# EAGLE design 2led_Arduino_V2 (EAGLE 8.7.1)
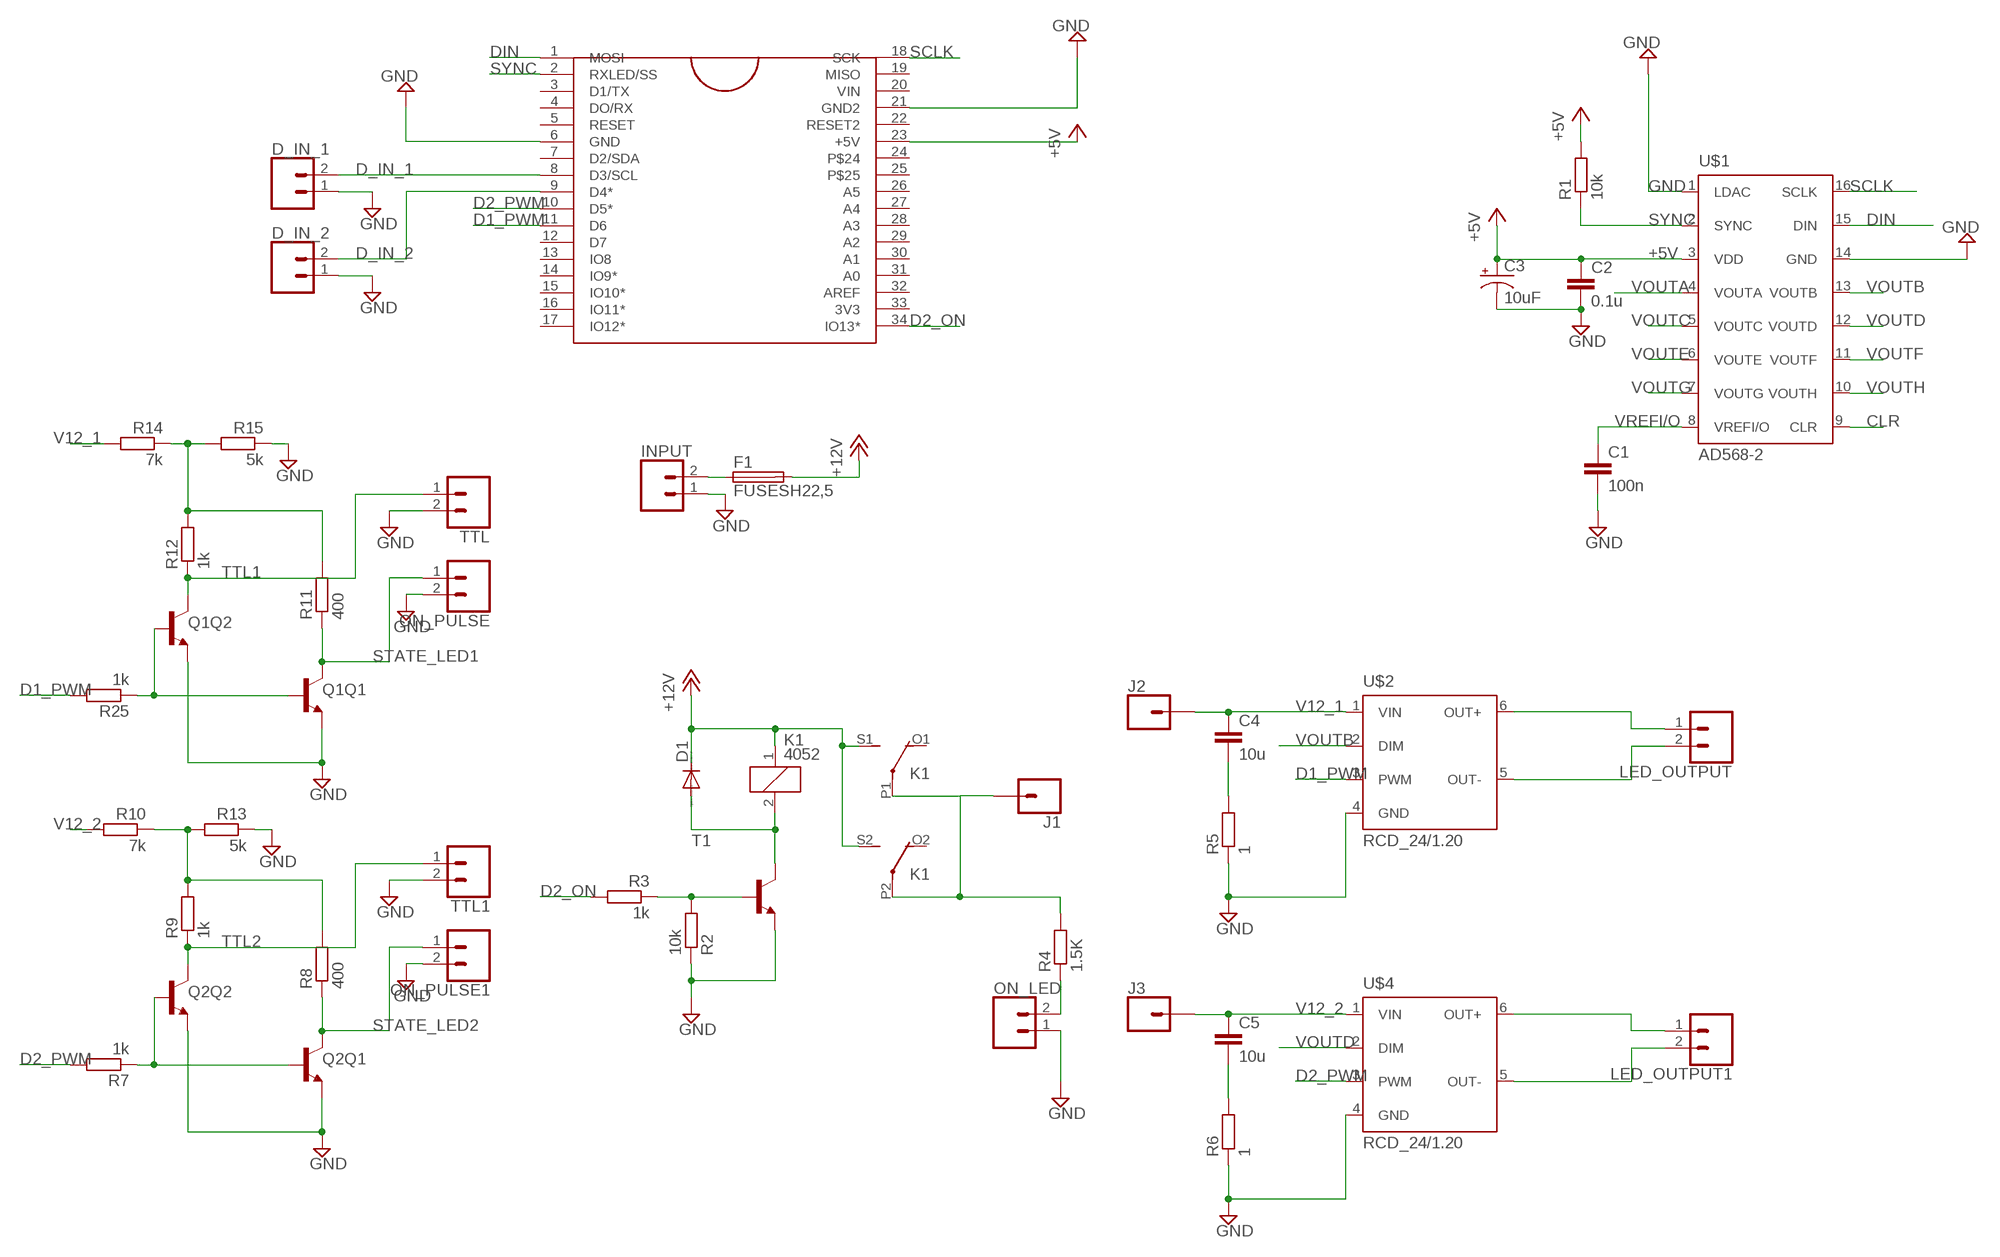
[diagram p0: schematic, sheet 1]

## Parts
C1  100n  C-EUC1206  [C1206]
C2  0.1u  C-EUC1206  [C1206]
C3  10uF  10UF-POLAR-EIA3528-20V-10%(TANT)  [EIA3528]
C4  10u  C-EUC1206  [C1206]
C5  10u  C-EUC1206  [C1206]
D1  DIODE-DO214AC  [DO214AC]
D_IN_1  CONN_02  [1X02]
D_IN_2  CONN_02  [1X02]
F1  FUSESH22,5  [SH22,5]
INPUT  CONN_023.5MM  [SCREWTERMINAL-3.5MM-2]
J1  CONN_01  [1X01]
J2  CONN_01  [1X01]
J3  CONN_01  [1X01]
K1  4052  [F4052]
LED_OUTPUT  CONN_023.5MM  [SCREWTERMINAL-3.5MM-2]
LED_OUTPUT1  CONN_023.5MM  [SCREWTERMINAL-3.5MM-2]
ON_LED  CONN_02  [1X02]
ON_PULSE  CONN_02  [1X02]
ON_PULSE1  CONN_02  [1X02]
Q1  TRANS_NPN_DUAL_NSM4002-MBT3904DW1T1  [SC70-6]
Q2  TRANS_NPN_DUAL_NSM4002-MBT3904DW1T1  [SC70-6]
R1  10k  R-EU_R0805  [R0805]
R2  10k  R-EU_R0805  [R0805]
R3  1k  R-EU_R0805  [R0805]
R4  1.5K  R-EU_R0805  [R0805]
R5  1  R-EU_R1206  [R1206]
R6  1  R-EU_R1206  [R1206]
R7  1k  R-EU_R0805  [R0805]
R8  400  R-EU_R0805  [R0805]
R9  1k  R-EU_R0805  [R0805]
R10  7k  R-EU_R0805  [R0805]
R11  400  R-EU_R0805  [R0805]
R12  1k  R-EU_R0805  [R0805]
R13  5k  R-EU_R0805  [R0805]
R14  7k  R-EU_R0805  [R0805]
R15  5k  R-EU_R0805  [R0805]
R25  1k  R-EU_R0805  [R0805]
T1  -NPN-SOT223  [SOT223]
TTL  CONN_02  [1X02]
TTL1  CONN_02  [1X02]
U$1  AD568-2  [TSSOP-16]
U$2  RCD_24/1.20  [RCD-24/W/X3]
U$3  ARDUINO_MICRO  [ARDUINO_MICRO_PADS]
U$4  RCD_24/1.20  [RCD-24/W/X3]

## Nets
12VIN: J1.1 K1.P1(2:P) K1.P2(3:P) R4.2
+5V: C2.1 C3.A(+) R1.2 U$1.3(VDD) U$3.23(+5V)
+12V: D1.C F1.2 K1.1 K1.S1(2:S) K1.S2(3:S)
CLR: U$1.9(CLR)
D1_PWM: R25.2 U$2.3(PWM) U$3.11(D6)
D2_ON: R3.2 U$3.34(IO13*)
D2_PWM: R7.2 U$3.10(D5*) U$4.3(PWM)
D_IN_1: D_IN_1.2 U$3.8(D3/SCL)
D_IN_2: D_IN_2.2 U$3.9(D4*)
DIN: U$1.15(DIN) U$3.1(MOSI)
GND: C1.2 C2.2 C3.C(-) D_IN_1.1 D_IN_2.1 INPUT.1 ON_LED.1 ON_PULSE1.2 ON_PULSE.2 Q1.1(Q2:E) Q1.4(Q1:E) Q2.1(Q2:E) Q2.4(Q1:E) R2.1 R5.1 R6.1 R13.1 R15.1 T1.3(E) TTL1.2 TTL.2 U$1.1(LDAC) U$1.14(GND) U$2.4(GND) U$3.6(GND) U$3.21(GND2) U$4.4(GND)
N$1: C4.2 R5.2
N$2: D1.A K1.2 T1.4(C)
N$3: F1.1 INPUT.2
N$4: ON_LED.2 R4.1
N$5: R2.2 R3.1 T1.1(B)
N$6: LED_OUTPUT.2 U$2.5(OUT-)
N$7: LED_OUTPUT.1 U$2.6(OUT+)
N$8: LED_OUTPUT1.2 U$4.5(OUT-)
N$9: LED_OUTPUT1.1 U$4.6(OUT+)
N$10: Q1.2(Q2:B) Q1.5(Q1:B) R25.1
N$11: C5.2 R6.2
N$12: Q2.2(Q2:B) Q2.5(Q1:B) R7.1
N$14: R8.2 R9.2 R10.1 R13.2
N$16: R11.2 R12.2 R14.1 R15.2
SCLK: U$1.16(SCLK) U$3.18(SCK)
STATE_LED1: ON_PULSE.1 Q1.3(Q1:C) R11.1
STATE_LED2: ON_PULSE1.1 Q2.3(Q1:C) R8.1
SYNC: R1.1 U$1.2(SYNC) U$3.2(RXLED/SS)
TTL1: Q1.6(Q2:C) R12.1 TTL.1
TTL2: Q2.6(Q2:C) R9.1 TTL1.1
V12_1: C4.1 J2.1 R14.2 U$2.1(VIN)
V12_2: C5.1 J3.1 R10.2 U$4.1(VIN)
VOUTA: U$1.4(VOUTA)
VOUTB: U$1.13(VOUTB) U$2.2(DIM)
VOUTC: U$1.5(VOUTC)
VOUTD: U$1.12(VOUTD) U$4.2(DIM)
VOUTE: U$1.6(VOUTE)
VOUTF: U$1.11(VOUTF)
VOUTG: U$1.7(VOUTG)
VOUTH: U$1.10(VOUTH)
VREFI/O: C1.1 U$1.8(VREFI/O)
Unconnected: K1.O1(2:O) K1.O2(3:O) U$3.3(D1/TX) U$3.4(DO/RX) U$3.5(RESET) U$3.7(D2/SDA) U$3.12(D7) U$3.13(IO8) U$3.14(IO9*) U$3.15(IO10*) U$3.16(IO11*) U$3.17(IO12*) U$3.19(MISO) U$3.20(VIN) U$3.22(RESET2) U$3.24 U$3.25 U$3.26(A5) U$3.27(A4) U$3.28(A3) U$3.29(A2) U$3.30(A1) U$3.31(A0) U$3.32(AREF) U$3.33(3V3)

## Library data of the parts
C1 C2 C4 C5 = rcl:C-EU: CAPACITOR, European symbol; SPICEPREFIX: C
C3 = SparkFun-Capacitors:10UF-POLAR: 10.0µF polarized capacitors A capacitor is a passive two-terminal electrical component used to store electrical energy temporarily in an electric field.; PROD_ID: CAP-08063
D1 = diode:DIODE-: DIODE
D_IN_1 D_IN_2 ON_LED ON_PULSE ON_PULSE1 TTL TTL1 = SparkFun-Connectors:CONN_02: Multi connection point. Often used as Generic Header-pin footprint for 0.1 inch spaced/style header connections On any of the 0.1 inch spaced packages, you can populate with these: Break Away Headers - Straight <https://www.sparkfun.com/products/116> (PRT-00116) Break Away Male Headers - Right Angle <https://www.sparkfun.com/products/553> (PRT-00553) Female Headers <https://www.sparkfun.com/products/115> (PRT-00115) Break Away Headers - Machine Pin <https://www.sparkfun.com/products/117> (PRT-00117) Break Away Female Headers - Swiss Machine Pin <https://www.sparkfun.com/products/743> (PRT-00743) For SCREWTERMINALS and SPRING TERMINALS visit here: Screw Terimnals on SparkFun.com <https://www.sparkfun.com/search/results?term=Screw+Terminals> (5mm/3.5mm/2.54mm spacing) This device is also useful as a general connection point to wire up your design to another part of your project. Our various solder wires solder well into these plated through hole pads. Hook-Up Wire - Assortment (Stranded, 22 AWG) <https://www.sparkfun.com/products/11375> (PRT-11375) Hook-Up Wire - Assortment (Solid Core, 22 AWG) <https://www.sparkfun.com/products/11367> (PRT-11367) View the entire wire category on our website here <https://www.sparkfun.com/categories/141> Special notes: Molex polarized connector foot print use with: PRT-08233 with associated crimp pins and housings. 2.54_SCREWTERM for use with PRT-10571. 3.5mm Screw Terminal footprints for PRT-08084 5mm Screw Terminal footprints for use with PRT-08432
F1 = fuse:FUSE: Fuse; OC_FARNELL: unknown; OC_NEWARK: unknown
INPUT LED_OUTPUT LED_OUTPUT1 = SparkFun-Connectors:CONN_02: Multi connection point. Often used as Generic Header-pin footprint for 0.1 inch spaced/style header connections On any of the 0.1 inch spaced packages, you can populate with these: Break Away Headers - Straight <https://www.sparkfun.com/products/116> (PRT-00116) Break Away Male Headers - Right Angle <https://www.sparkfun.com/products/553> (PRT-00553) Female Headers <https://www.sparkfun.com/products/115> (PRT-00115) Break Away Headers - Machine Pin <https://www.sparkfun.com/products/117> (PRT-00117) Break Away Female Headers - Swiss Machine Pin <https://www.sparkfun.com/products/743> (PRT-00743) For SCREWTERMINALS and SPRING TERMINALS visit here: Screw Terimnals on SparkFun.com <https://www.sparkfun.com/search/results?term=Screw+Terminals> (5mm/3.5mm/2.54mm spacing) This device is also useful as a general connection point to wire up your design to another part of your project. Our various solder wires solder well into these plated through hole pads. Hook-Up Wire - Assortment (Stranded, 22 AWG) <https://www.sparkfun.com/products/11375> (PRT-11375) Hook-Up Wire - Assortment (Solid Core, 22 AWG) <https://www.sparkfun.com/products/11367> (PRT-11367) View the entire wire category on our website here <https://www.sparkfun.com/categories/141> Special notes: Molex polarized connector foot print use with: PRT-08233 with associated crimp pins and housings. 2.54_SCREWTERM for use with PRT-10571. 3.5mm Screw Terminal footprints for PRT-08084 5mm Screw Terminal footprints for use with PRT-08432; PROD_ID: CONN-08399
J1-J3 = SparkFun-Connectors:CONN_01: Single connection point. Often used as Generic Header-pin footprint for 0.1 inch spaced/style header connections On any of the 0.1 inch spaced packages, you can populate with these: Break Away Headers - Straight <https://www.sparkfun.com/products/116> (PRT-00116) Break Away Male Headers - Right Angle <https://www.sparkfun.com/products/553> (PRT-00553) Female Headers <https://www.sparkfun.com/products/115> (PRT-00115) Break Away Headers - Machine Pin <https://www.sparkfun.com/products/117> (PRT-00117) Break Away Female Headers - Swiss Machine Pin <https://www.sparkfun.com/products/743> (PRT-00743) This device is also useful as a general connection point to wire up your design to another part of your project. Our various solder wires solder well into these plated through hole pads. Hook-Up Wire - Assortment (Stranded, 22 AWG) <https://www.sparkfun.com/products/11375> (PRT-11375) Hook-Up Wire - Assortment (Solid Core, 22 AWG) <https://www.sparkfun.com/products/11367> (PRT-11367) View the entire wire category on our website here <https://www.sparkfun.com/categories/141> Special notes: SMTSO-256-ET is a "flush mount" nut for a 4-40 screw. We mostly use this on specialty testbeds; it is a nice way to connect hardware to your PCB at an adjustable hieght. Also note, the SNAP packages are for using a snappable style connector. We sell a baggie of snaps and they are also used on two LilyPad designs: Snap Assortment - 30 pack (male and female) <https://www.sparkfun.com/products/11347> (DEV-11347) LilyPad Arduino SimpleSnap <https://www.sparkfun.com/products/10941> (DEV-10941) LilyPad SimpleSnap Protoboard <https://www.sparkfun.com/products/10940> (DEV-10940)
K1 = relay:4052: RELAY 2 x switch, Finder; OC_FARNELL: unknown; OC_NEWARK: unknown
Q1 Q2 = SparkFun-DiscreteSemi:TRANS_NPN_DUAL_NSM4002: Dual NPN Transistors in Single Package The MBT3904W1 puts two general purpose 3904 NPN transistors in a single package. Datasheet <http://www.onsemi.com/pub_link/Collateral/MBT3904DW1T1-D.PDF> SparkFun Products: SparkFun ESP32 Thing <https://www.sparkfun.com/products/13907>; PROD_ID: TRANS-13337
R1-R15 R25 = rcl:R-EU_: RESISTOR, European symbol; SPICEPREFIX: R
T1 = transistor-neu-to92:*-NPN-: NPN Transistror
U$1 = opto_stimulation:AD568-2
U$2 U$4 = opto_stimulation:RCD_24/1.20
U$3 = opto_stimulation:ARDUINO_MICRO; SPICEPREFIX: X

## Board
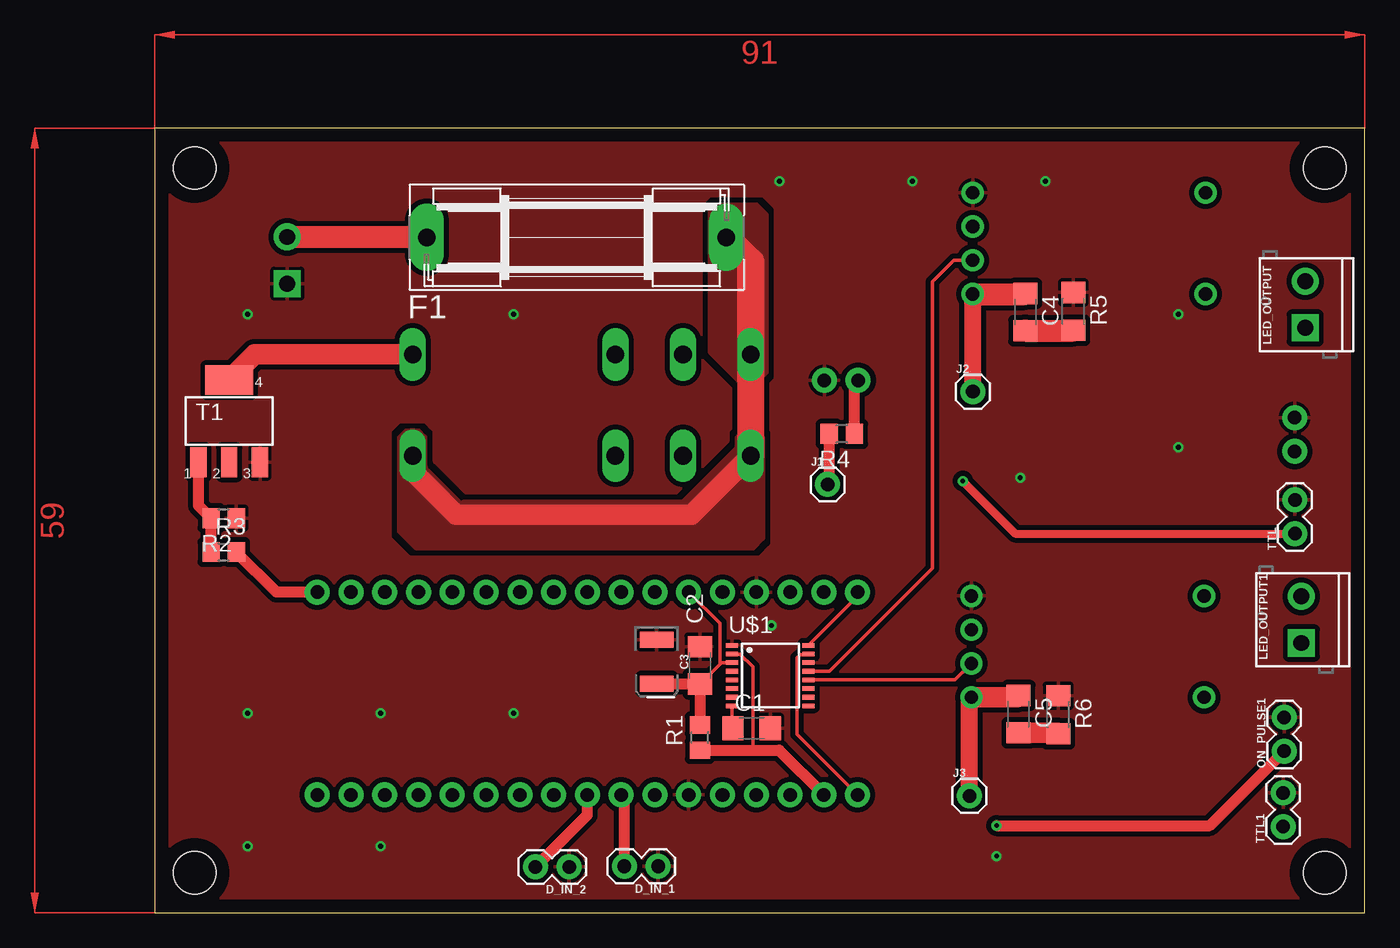
[diagram p1: board, top side]
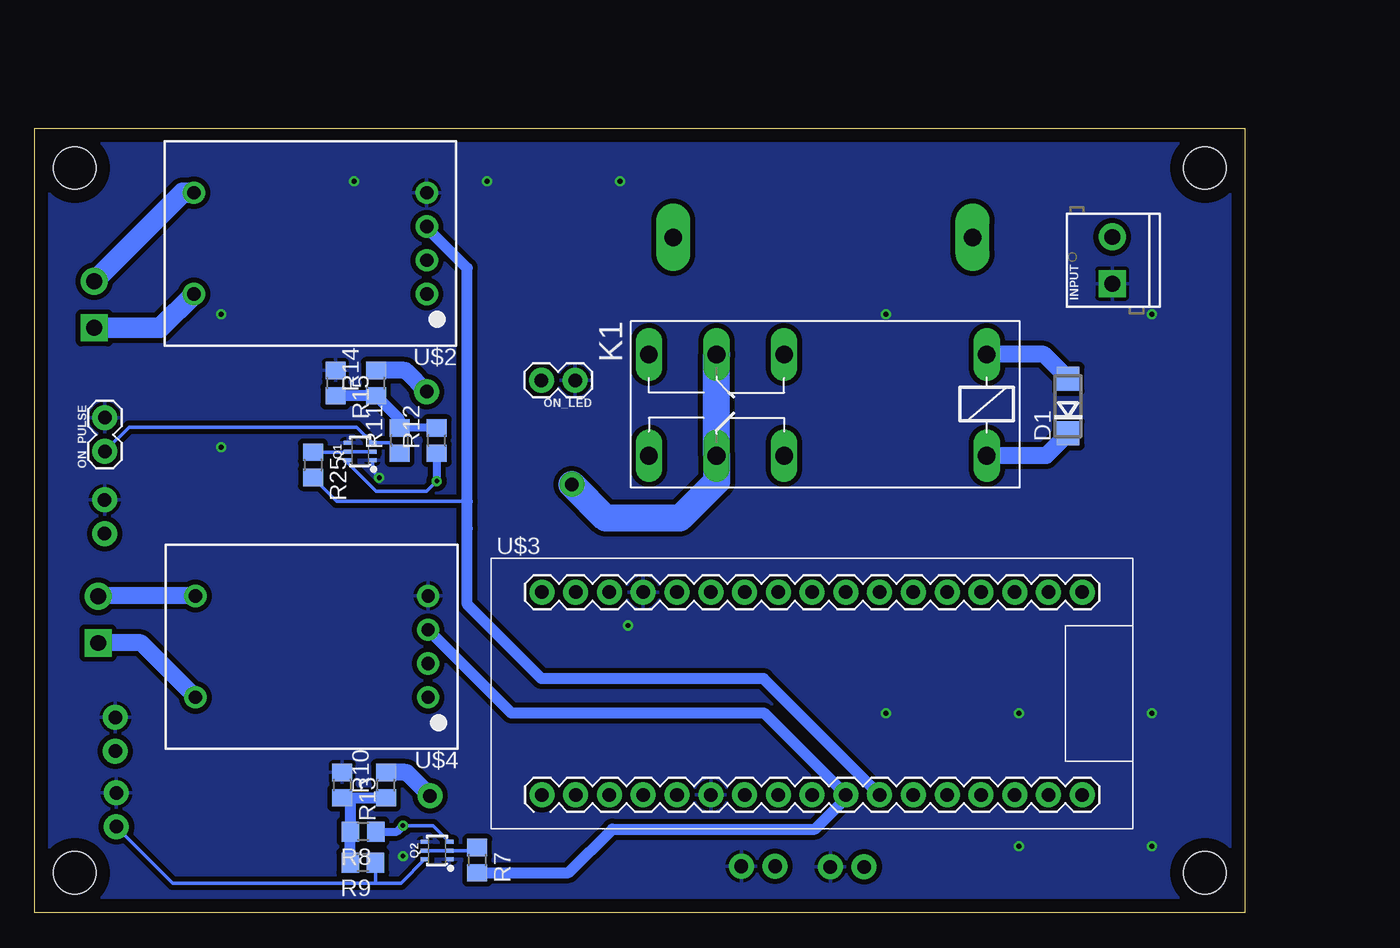
[diagram p2: board, bottom side, seen from below]

Size 91 x 59 mm. Coordinates in mm from the lower left corner, seen from the top.
Outline: 0,0 91,0 91,59 0,59 0,0
Copper layers (1*16): Top 0.035mm / dielectric 1.5mm / Bottom 0.035mm
Design rules "default *": minimum track width 6mil, minimum drill 0.35mm, track to track 15mil, track to pad 12mil, pad to pad 10mil, via to via 15mil, smd to smd 6mil, copper to edge 40mil, drill to drill 6mil, minimum pad ring 10mil, minimum via ring 8mil, stop-mask expansion 4mil, vias tented up to drill 0mil, thermal gap 10mil
Holes 3.2 mm at 3,3 88,3 88,56 3,56

### Footprints (pad centres in the part's own frame; a part is rotated, then mirrored left to right if it is on the bottom)
C1206 = smd 1.6 x 1.8: 1 -1.4,0; 2 1.4,0
EIA3528 = smd 1.2 x 2.5: A 1.65,0; C -1.65,0
DO214AC = smd 1.8 x 1.7: A 2.05,0; C -2.05,0
1X02 = drill 1.016 pad 1.88: 1 0,0; 2 2.54,0
SH22,5 = drill 1.321 pad 2.54 long: 1 -11.252,0; 2 11.252,0
SCREWTERMINAL-3.5MM-2 = drill 1.2 pad 2.032 square: 1 0,0 | drill 1.2 pad 2.032: 2 3.5,0
1X01 = drill 1.016 pad 1.88: 1 0,0
F4052 = drill 1.321 long: 1 -3.81,3.81; 2 -3.81,-3.81; O1 11.43,-3.81; O2 11.43,3.81; P1 16.51,-3.81; P2 16.51,3.81; S1 21.59,-3.81; S2 21.59,3.81
SC70-6 = smd 0.3 x 0.66: 1 -0.65,-0.92; 2 0,-0.92; 3 0.65,-0.92; 4 0.65,0.92; 5 0,0.92; 6 -0.65,0.92
R0805 = smd 1.3 x 1.5: 1 -0.95,0; 2 0.95,0
R1206 = smd 1.6 x 1.803: 1 -1.422,0; 2 1.422,0
SOT223 = smd 1.219 x 2.235: 1 -2.311,-3.099; 2 0,-3.099; 3 2.311,-3.099 | smd 3.6 x 2.2: 4 0,3.099
TSSOP-16 = smd 0.9 x 0.35: 1 -2.875,2.275; 2 -2.875,1.625; 3 -2.875,0.975; 4 -2.875,0.325; 5 -2.875,-0.325; 6 -2.875,-0.975; 7 -2.875,-1.625; 8 -2.875,-2.275; 9 2.875,-2.275; 10 2.875,-1.625; 11 2.875,-0.975; 12 2.875,-0.325; 13 2.875,0.325; 14 2.875,0.975; 15 2.875,1.625; 16 2.875,2.275
RCD-24/W/X3 = drill 1 pad 1.676: 1 -8.75,3.81; 2 -8.75,1.27; 3 -8.75,-1.27; 4 -8.75,-3.81; 5 8.75,-3.81; 6 8.75,3.81
ARDUINO_MICRO_PADS = drill 1.016 pad 1.88: 1 0,0; 2 2.54,0; 3 5.08,0; 4 7.62,0; 5 10.16,0; 6 12.7,0; 7 15.24,0; 8 17.78,0; 9 20.32,0; 10 22.86,0; 11 25.4,0; 12 27.94,0; 13 30.48,0; 14 33.02,0; 15 35.56,0; 16 38.1,0; 17 40.64,0; 18 0,15.24; 19 2.54,15.24; 20 5.08,15.24; 21 7.62,15.24; 22 10.16,15.24; 23 12.7,15.24; 24 15.24,15.24; 25 17.78,15.24; 26 20.32,15.24; 27 22.86,15.24; 28 25.4,15.24; 29 27.94,15.24; 30 30.48,15.24; 31 33.02,15.24; 32 35.56,15.24; 33 38.1,15.24; 34 40.64,15.24

### Placement (x,y rotation side)
C1  44.91,13.88 0 top
C2  41.01,18.6 90 top
C3  37.76,18.86 270 top
C4  65.48,45.17 270 top
C5  64.97,14.93 270 top
D1  13.29,38.09 90 bottom
D_IN_1  37.87,3.5 180 top
D_IN_2  31.18,3.45 180 top
F1  31.74,50.79 0 top
INPUT  9.98,47.31 90 bottom
J1  50.62,32.21 0 top
J2  61.54,39.18 0 top
J3  61.29,8.8 0 top
K1  23.23,38.18 180 bottom
LED_OUTPUT  86.54,43.98 90 top
LED_OUTPUT1  86.25,20.29 90 top
ON_LED  50.38,40.03 180 bottom
ON_PULSE  85.74,34.69 90 bottom
ON_PULSE1  84.95,12.15 90 top
Q1  66.54,34.68 90 bottom
Q2  60.76,4.68 90 bottom
R1  41,13.18 90 top
R2  5.2,29.68 180 top
R3  5.2,27.13 0 top
R4  51.68,36.01 180 top
R5  69.1,45.22 270 top
R6  67.96,14.89 270 top
R7  57.74,3.96 270 bottom
R8  66.32,6.1 180 bottom
R9  66.34,3.77 180 bottom
R10  64.59,9.6 90 bottom
R11  63.58,35.51 90 bottom
R12  60.78,35.51 90 bottom
R13  67.89,9.6 270 bottom
R14  65.35,39.83 90 bottom
R15  68.4,39.83 270 bottom
R25  70.09,33.68 270 bottom
T1  5.61,36.97 0 top
TTL  85.76,28.5 90 top
TTL1  84.87,6.47 90 top
U$1  46.32,17.84 0 top
U$2  70.28,50.33 180 bottom
U$3  52.87,8.87 0 bottom
U$4  70.18,20.01 180 bottom

### Tracks (layer width: path | path; a pad name or v marks a point on that pad's centre or on a via)
12VIN
  Top 0.813: R4.2 50.73,32.32 J1.1
  Bottom 2.032: K1.P1 K1.P2 39.74,32.42 42.49,29.67 48.08,29.67 J1.1
+5V
  Top 0.254: C2.1 42.51,18.69 | 42.51,18.69 42.63,18.81 U$1.3 | U$3.23 42.51,21.77 42.51,18.69
  Top 0.813: C3.A 37.78,17.2 C2.1 41.01,14.14 R1.2
+12V
  Top 1.524: K1.1 19.42,33.18 22.68,29.92 40.37,29.92 K1.S2
  Top 2.032: F1.2 44.82,48.96 K1.S1 K1.S2
  Bottom 1.27: D1.C 14.96,34.37 K1.1
  pour Top (no thermals): 41.73,52.53 41.73,49.22 41.73,42.22 arc45 41.81,42.04 44.02,39.83 45.18,39.83 arc45 45.36,39.9 46.05,40.59 46.05,52.42 arc45 45.98,52.6 45.8,52.78 45.36,53.21 arc45 45.18,53.29 42.24,53.29 41.81,52.85 arc45 41.73,52.67
  pour Top (no thermals): 18.36,35.76 18.87,36.27 19.89,36.27 20.32,35.84 arc-45 20.4,35.66 20.4,35.51 20.4,33.58 arc45 20.47,33.4 20.65,33.22 22.86,31.01 arc-45 22.94,30.83 22.94,30.68 23.12,30.86 arc-45 23.3,30.94 39.7,30.94 43.69,34.93 arc45 43.76,35.11 43.76,35.76 44.27,36.27 45.29,36.27 45.8,35.76 45.8,28.25 arc-45 45.72,28.07 45.03,27.38 19.74,27.38 arc-45 19.56,27.45 18.62,28.4 18.36,28.65
D1_PWM
  Bottom 0.254: 58.66,28.74 58.5,28.9 | R25.2 68.3,30.94 58.5,30.94
  Bottom 0.813: U$2.3 61.53,51.5 58.5,48.46 58.5,30.94 58.5,28.9 58.5,23.2 52.9,17.6 36.2,17.6 U$3.11
D2_ON
  Top 0.813: U$3.34 9.17,24.11 R3.2
D2_PWM
  Bottom 0.813: R7.2 50.86,3.01 47.57,6.3 32.33,6.3 30.01,8.62 U$3.10 36.17,15.03 55.17,15.03 U$4.3
D_IN_1
  Top 0.813: D_IN_1.2 35.33,8.62 U$3.8
D_IN_2
  Top 0.813: D_IN_2.2 32.55,7.37 U$3.9
DIN
  Top 0.254: U$1.15 49.15,19.42 48.56,19.42 48.31,19.16 48.31,13.43 U$3.1
GND  (via drill 0.35)
  Bottom 0.254: v65.1,32.71 65.62,33.23 Q1.1
  other vias: 63.32,4.27 7,15 7,5 17,5 17,15 27,15 7,45 27,45 57,55 47,55 77,35 77,45 67,55 46.4,21.6
  pour Top (isolate 0.254, rank 2): 0,59 1,0 91,0 91,59
  pour Bottom (isolate 0.254, rank 2): 0.51,59 0,0 91,0 91.51,59
N$1
  Top 1.651: C4.2 69.07,43.77 R5.2
N$2
  Top 1.524: K1.2 7.53,41.99 T1.4
  Bottom 1.27: D1.A 15.13,41.99 K1.2
N$3
  Top 1.651: F1.1 10.01,50.79 INPUT.2
N$4
  Top 0.813: R4.1 52.63,39.75 ON_LED.2
N$5
  Top 0.813: T1.1 3.3,30.62 R2.2 R3.1
N$6
  Bottom 1.524: LED_OUTPUT.2 79.88,54.14 U$2.5
N$7
  Bottom 1.524: LED_OUTPUT.1 81.57,43.98 U$2.6
N$8
  Bottom 1.27: U$4.5 86.22,23.82 LED_OUTPUT1.2
N$9
  Bottom 1.27: U$4.6 83.01,20.29 LED_OUTPUT1.1
N$10
  Bottom 0.254: Q1.2 Q1.5 67.47,34.66 67.72,34.66 67.75,34.63 R25.1
N$11
  Top 1.524: C5.2 67.9,13.53 R6.2
N$12
  Bottom 0.254: Q2.5 Q2.2 57.98,4.68 R7.1
N$14
  Bottom 0.813: R9.2 67.29,6.08 R8.2 67.27,8.53 67.39,8.65 | R13.2 67.39,8.65 | 67.39,8.65 R10.1
N$16
  Bottom 0.61: R12.2 R11.2
  Bottom 0.813: R15.2 R14.1 63.58,37.1 R11.2
SCLK
  Top 0.254: U$1.16 52.87,23.79 U$3.18
STATE_LED1
  Bottom 0.254: R11.1 64.34,35.33 Q1.3 66.81,36.52 83.91,36.52 ON_PULSE.1
STATE_LED2  (via drill 0.35)
  Top 0.813: v63.32,6.55 79.35,6.55 ON_PULSE1.1
  Bottom 0.254: v63.32,6.55 61.06,6.55 Q2.3
  Bottom 0.61: R8.1 63.77,6.1 v63.32,6.55
SYNC
  Top 0.254: U$1.2 43.46,19.45 44.04,19.45 45,18.49 45,12.23
  Top 0.813: R1.1 45,12.23 46.97,12.23 U$3.2
TTL1  (via drill 0.35)
  Top 0.61: v60.78,32.46 64.74,28.5 TTL.1
  Bottom 0.254: Q1.6 67.46,33.8 65.35,31.7 61.54,31.7 v60.78,32.46
  Bottom 0.61: R12.1 v60.78,32.46
TTL2
  Bottom 0.254: Q2.6 63.47,2.23 65.35,2.23 | TTL1.1 80.64,2.23 65.35,2.23 | R9.1 65.39,2.27 65.35,2.23
V12_1
  Top 1.27: J2.1 61.54,46.51 U$2.1
  Top 1.651: U$2.1 65.43,46.52 C4.1
  Bottom 1.27: J2.1 63.07,40.7 arc-45 63.24,40.78 R14.2
V12_2
  Top 1.27: J3.1 61.29,16.06 U$4.1
  Top 1.524: U$4.1 64.84,16.2 C5.1
  Bottom 1.27: J3.1 62.97,10.48 arc-45 63.15,10.55 R10.2
VOUTB
  Top 0.254: U$2.2 60.11,49.06 58.5,47.45 58.5,27.2 58.5,25.9 50.76,18.16 U$1.13
VOUTD
  Top 0.254: 60.83,18.14 U$4.2 60.2,17.51 U$1.12
VREFI/O
  Top 0.254: U$1.8 43.44,13.94 C1.1
(copper drawn outside any net)
  shapes: Top area x2